# EAGLE schematic node (EAGLE 9.4.2)
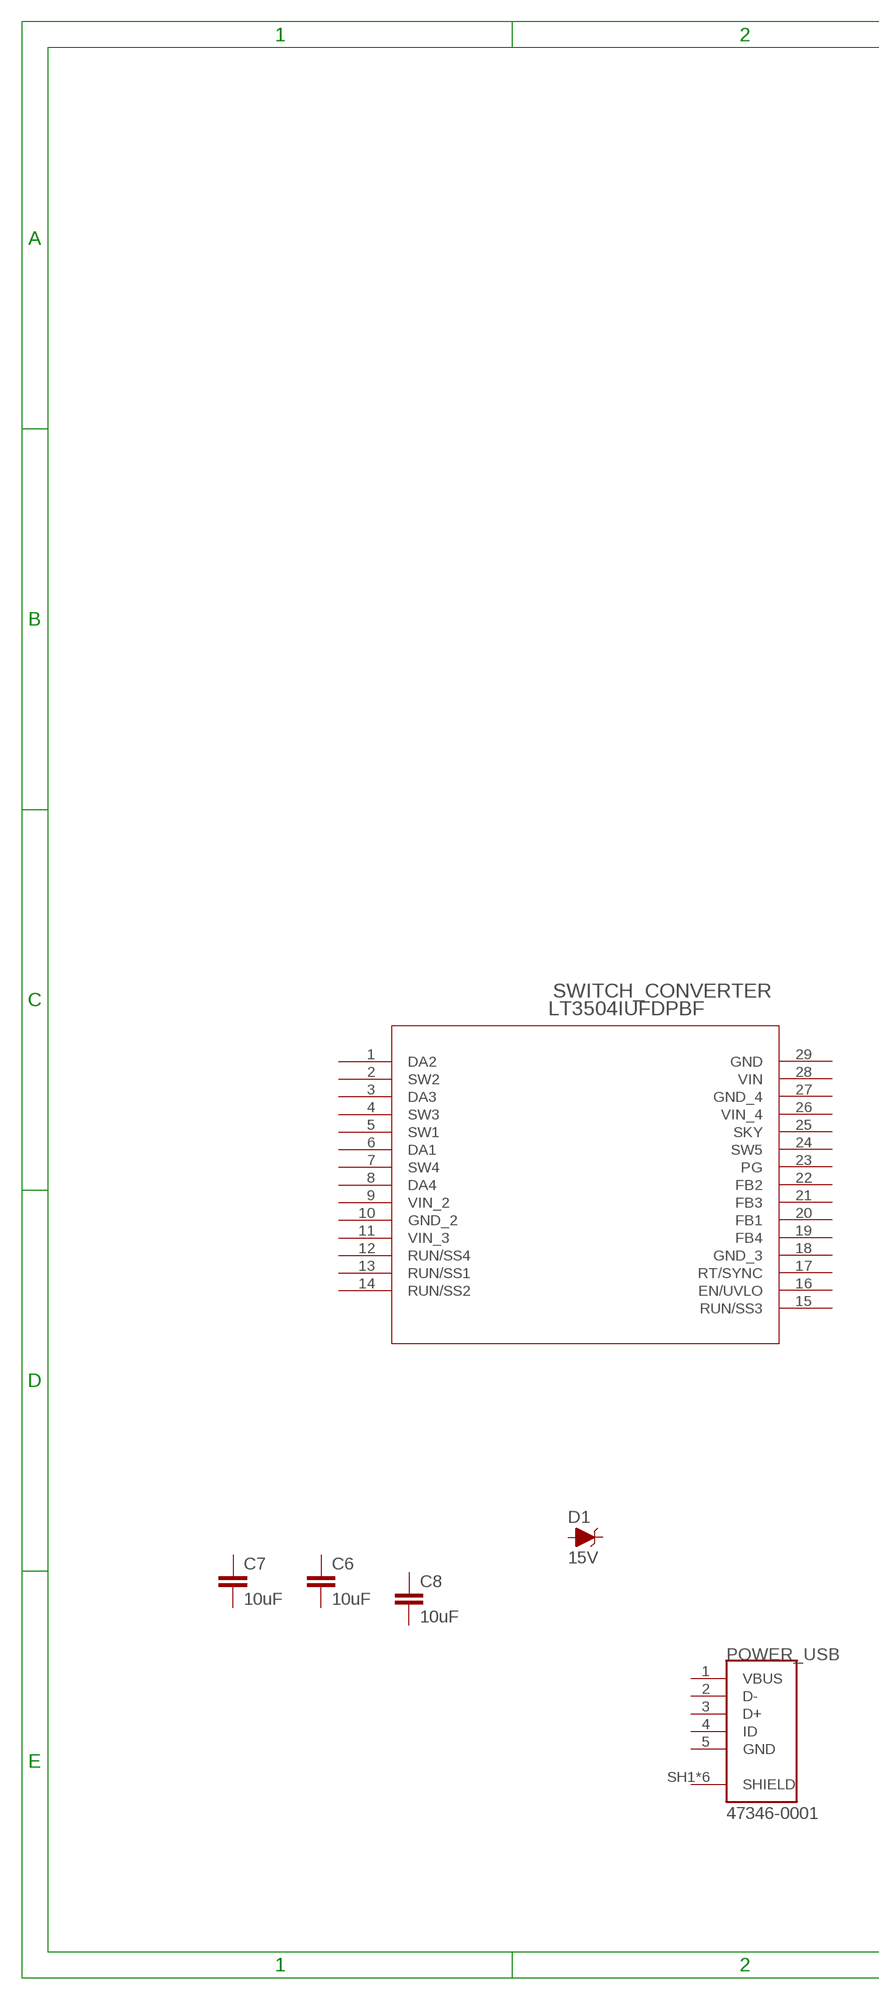
[diagram p0: schematic, sheet 1, part 1 of 2]
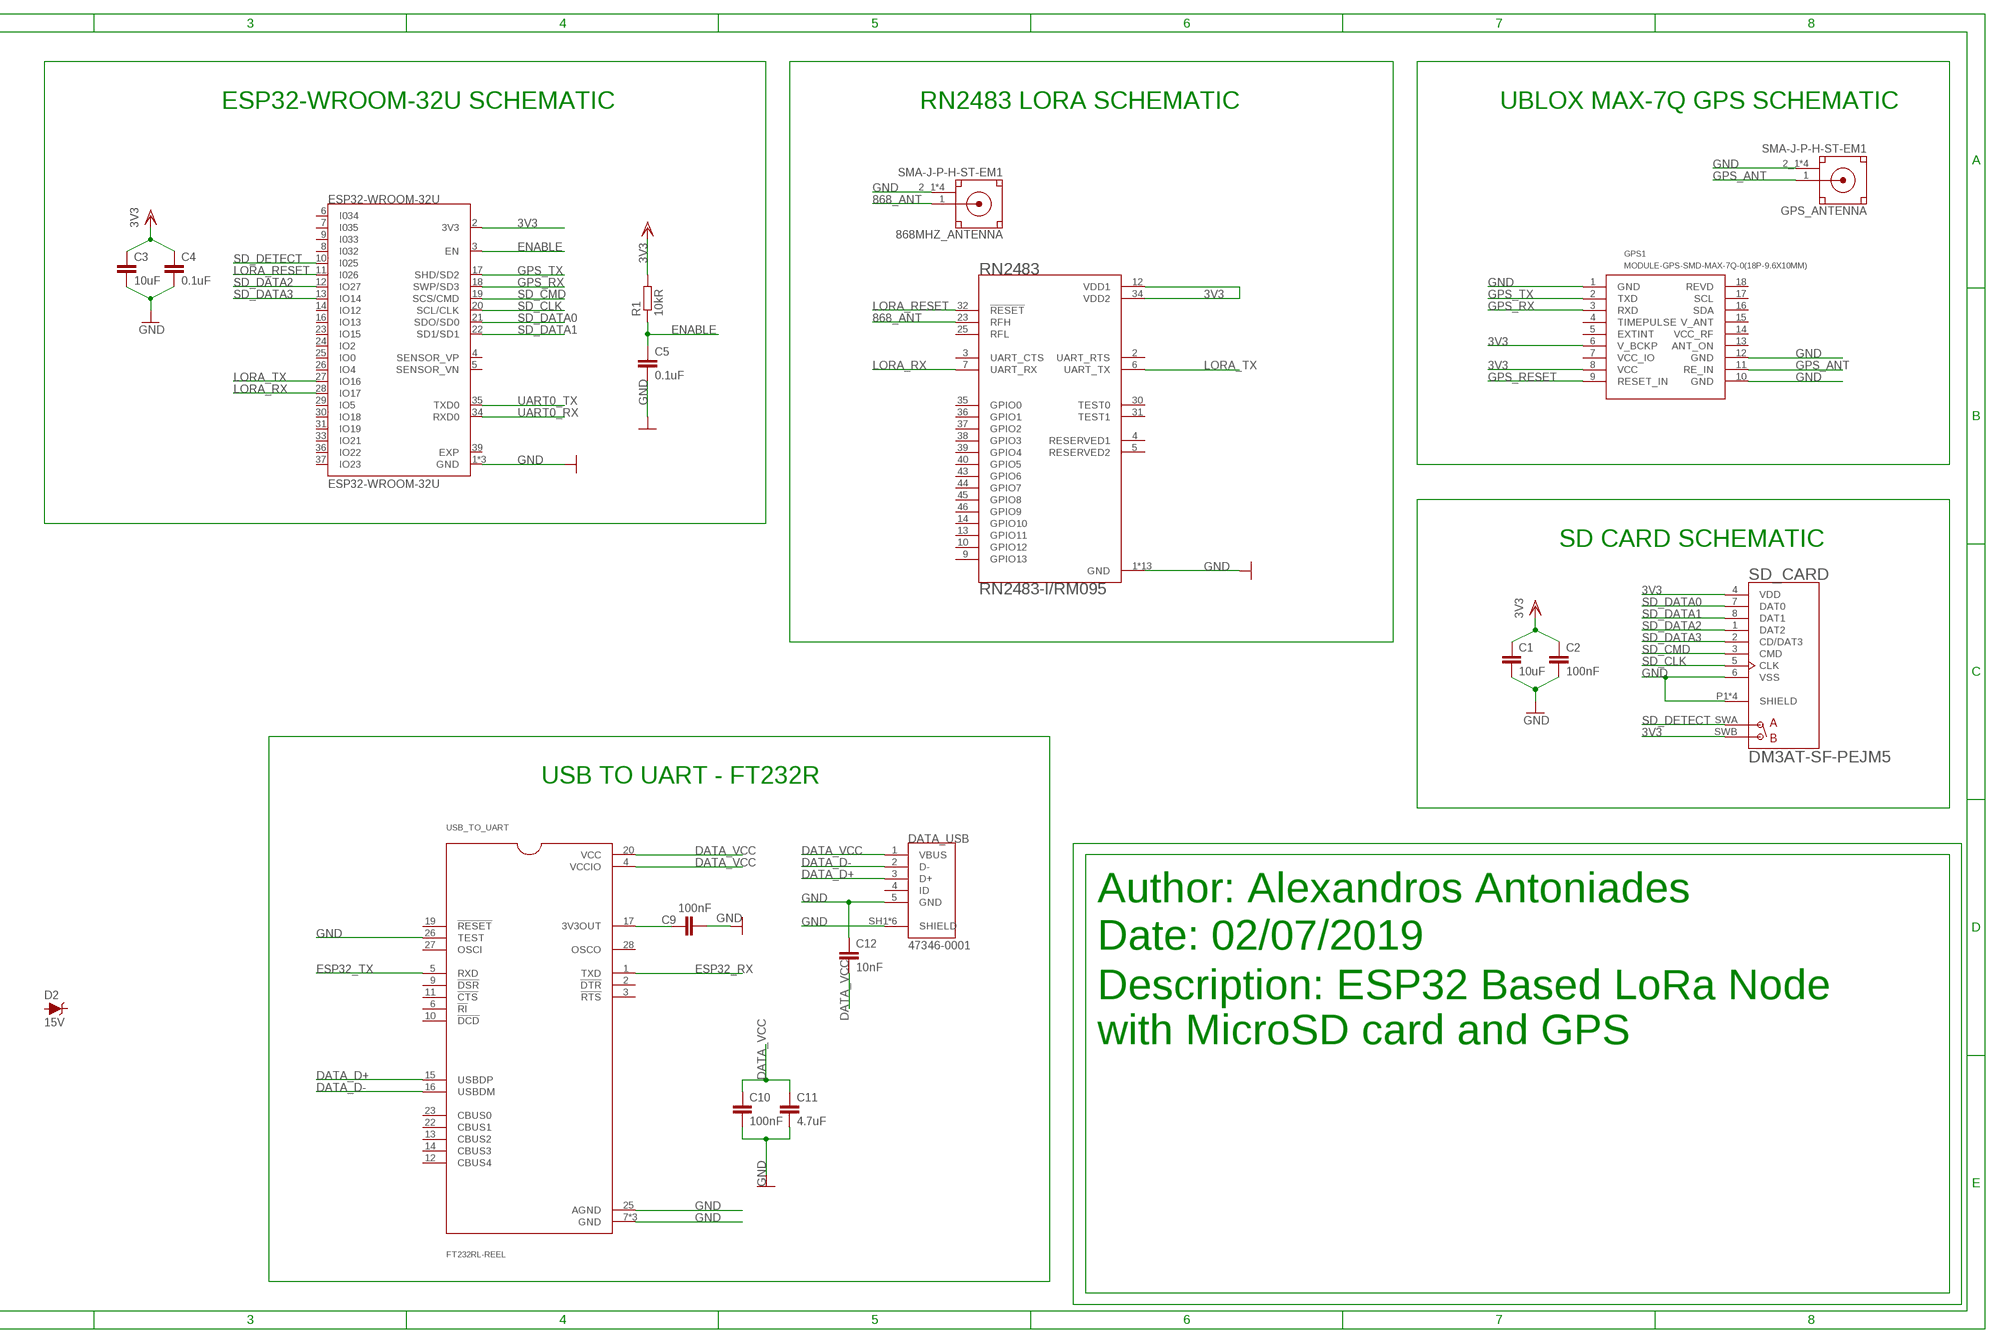
[diagram p1: schematic, sheet 1, part 2 of 2]

## Parts
868MHZ_ANTENNA  SMA-J-P-H-ST-EM1  [SMA-J-P-H-ST-EM1]
C1  10uF  C-EUC0603  [C0603]
C2  100nF  C-EUC0603  [C0603]
C3  10uF  C-EUC0603  [C0603]
C4  0.1uF  C-EUC0603  [C0603]
C5  0.1uF  C-EUC0603  [C0603]
C6  10uF  C-EUC0603  [C0603]
C7  10uF  C-EUC0603  [C0603]
C8  10uF  C-EUC0603  [C0603]
C9  100nF  C-EUC0603  [C0603]
C10  100nF  C-EUC0603  [C0603]
C11  4.7uF  C-EUC0603  [C0603]
C12  10nF  C-EUC0603  [C0603]
D1  15V  DIODE-ZENER-DZ2J150M0L  [PANASONIC_SMINI2-F5-B]
D2  15V  DIODE-ZENER-DZ2J150M0L  [PANASONIC_SMINI2-F5-B]
DATA_USB  47346-0001  [MOLEX_47346-0001]
ESP32-WROOM-32U  ESP32-WROOM-32U  [XCVR_ESP32-WROOM-32U]
GPS1  MODULE-GPS-SMD-MAX-7Q-0(18P-9.6X10MM)  [GPS18P-SMD-1.1-10X9.6MM]
GPS_ANTENNA  SMA-J-P-H-ST-EM1  [SMA-J-P-H-ST-EM1]
POWER_USB  47346-0001  [MOLEX_47346-0001]
R1  10kR  R-EU_R0603  [R0603]
RN2483  RN2483-I/RM095  [MICROCHIP_RN2483-I/RM095]
SD_CARD  DM3AT-SF-PEJM5  [HRS_DM3AT-SF-PEJM5]
SWITCH_CONVERTER  LT3504IUFDPBF  [QFN-28_UFD]
USB_TO_UART  FT232RL-REEL  [SOP65P780X200-28N]

## Nets
3V3: C1.1 C2.1 C3.1 C4.1 ESP32-WROOM-32U.2(3V3) GPS1.6(V_BCKP) GPS1.8(VCC) R1.2 RN2483.12(VDD1) RN2483.34(VDD2) SD_CARD.4(VDD) SD_CARD.SWB(B) ; supply symbol labelled VDD
868_ANT: 868MHZ_ANTENNA.1(SIGNAL) RN2483.23(RFH)
DATA_D+: DATA_USB.3(D+) USB_TO_UART.15(USBDP)
DATA_D-: DATA_USB.2(D-) USB_TO_UART.16(USBDM)
DATA_VCC: C10.1 C11.1 C12.2 DATA_USB.1(VBUS) USB_TO_UART.4(VCCIO) USB_TO_UART.20(VCC)
ENABLE: C5.1 ESP32-WROOM-32U.3(EN) R1.1
ESP32_RX: USB_TO_UART.1(TXD)
ESP32_TX: USB_TO_UART.5(RXD)
GND: 868MHZ_ANTENNA.2_1(GND) 868MHZ_ANTENNA.2_2(GND) 868MHZ_ANTENNA.3_1(GND) 868MHZ_ANTENNA.3_2(GND) C1.2 C2.2 C3.2 C4.2 C5.2 C9.2 C10.2 C11.2 C12.1 DATA_USB.5(GND) DATA_USB.SH1(SHIELD) DATA_USB.SH2(SHIELD) DATA_USB.SH3(SHIELD) DATA_USB.SH4(SHIELD) DATA_USB.SH5(SHIELD) DATA_USB.SH6(SHIELD) ESP32-WROOM-32U.1(GND) ESP32-WROOM-32U.15(GND) ESP32-WROOM-32U.38(GND) GPS1.1(GND) GPS1.10(GND) GPS1.12(GND) GPS_ANTENNA.2_1(GND) GPS_ANTENNA.2_2(GND) GPS_ANTENNA.3_1(GND) GPS_ANTENNA.3_2(GND) RN2483.1(GND) RN2483.8(GND) RN2483.11(GND) RN2483.20(GND) RN2483.21(GND) RN2483.22(GND) RN2483.24(GND) RN2483.26(GND) RN2483.27(GND) RN2483.28(GND) RN2483.33(GND) RN2483.41(GND) RN2483.47(GND) SD_CARD.6(VSS) SD_CARD.P1(SHIELD) SD_CARD.P2(SHIELD) SD_CARD.P3(SHIELD) SD_CARD.P4(SHIELD) USB_TO_UART.7(GND) USB_TO_UART.18(GND) USB_TO_UART.21(GND) USB_TO_UART.25(AGND) USB_TO_UART.26(TEST)
GPS_ANT: GPS1.11(RE_IN) GPS_ANTENNA.1(SIGNAL)
GPS_RESET: GPS1.9(RESET_IN)
GPS_RX: ESP32-WROOM-32U.18(SWP/SD3) GPS1.3(RXD)
GPS_TX: ESP32-WROOM-32U.17(SHD/SD2) GPS1.2(TXD)
LORA_RESET: ESP32-WROOM-32U.11(I026) RN2483.32(!RESET)
LORA_RX: ESP32-WROOM-32U.28(IO17) RN2483.7(UART_RX)
LORA_TX: ESP32-WROOM-32U.27(IO16) RN2483.6(UART_TX)
N$8: C9.1 USB_TO_UART.17(3V3OUT)
SD_CLK: ESP32-WROOM-32U.20(SCL/CLK) SD_CARD.5(CLK)
SD_CMD: ESP32-WROOM-32U.19(SCS/CMD) SD_CARD.3(CMD)
SD_DATA0: ESP32-WROOM-32U.21(SDO/SD0) SD_CARD.7(DAT0)
SD_DATA1: ESP32-WROOM-32U.22(SD1/SD1) SD_CARD.8(DAT1)
SD_DATA2: ESP32-WROOM-32U.12(IO27) SD_CARD.1(DAT2)
SD_DATA3: ESP32-WROOM-32U.13(IO14) SD_CARD.2(CD/DAT3)
SD_DETECT: ESP32-WROOM-32U.10(I025) SD_CARD.SWA(A)
UART0_RX: ESP32-WROOM-32U.34(RXD0)
UART0_TX: ESP32-WROOM-32U.35(TXD0)
Unconnected: C6.1 C6.2 C7.1 C7.2 C8.1 C8.2 D1.A D1.C D2.A D2.C DATA_USB.4(ID) ESP32-WROOM-32U.4(SENSOR_VP) ESP32-WROOM-32U.5(SENSOR_VN) ESP32-WROOM-32U.6(I034) ESP32-WROOM-32U.7(I035) ESP32-WROOM-32U.8(I032) ESP32-WROOM-32U.9(I033) ESP32-WROOM-32U.14(IO12) ESP32-WROOM-32U.16(IO13) ESP32-WROOM-32U.23(IO15) ESP32-WROOM-32U.24(IO2) ESP32-WROOM-32U.25(IO0) ESP32-WROOM-32U.26(IO4) ESP32-WROOM-32U.29(IO5) ESP32-WROOM-32U.30(IO18) ESP32-WROOM-32U.31(IO19) ESP32-WROOM-32U.33(IO21) ESP32-WROOM-32U.36(IO22) ESP32-WROOM-32U.37(IO23) GPS1.4(TIMEPULSE) GPS1.5(EXTINT) GPS1.7(VCC_IO) GPS1.13(ANT_ON) GPS1.14(VCC_RF) GPS1.15(V_ANT) GPS1.16(SDA) GPS1.17(SCL) GPS1.18(REVD) POWER_USB.2(D-) POWER_USB.3(D+) POWER_USB.4(ID) POWER_USB.SH1(SHIELD) POWER_USB.SH2(SHIELD) POWER_USB.SH3(SHIELD) POWER_USB.SH4(SHIELD) POWER_USB.SH5(SHIELD) POWER_USB.SH6(SHIELD) RN2483.2(UART_RTS) RN2483.3(UART_CTS) RN2483.4(RESERVED1) RN2483.5(RESERVED2) RN2483.9(GPIO13) RN2483.10(GPIO12) RN2483.13(GPIO11) RN2483.14(GPIO10) RN2483.25(RFL) RN2483.30(TEST0) RN2483.31(TEST1) RN2483.35(GPIO0) RN2483.36(GPIO1) RN2483.37(GPIO2) RN2483.38(GPIO3) RN2483.39(GPIO4) RN2483.40(GPIO5) RN2483.43(GPIO6) RN2483.44(GPIO7) RN2483.45(GPIO8) RN2483.46(GPIO9) SWITCH_CONVERTER.1(DA2) SWITCH_CONVERTER.2(SW2) SWITCH_CONVERTER.3(DA3) SWITCH_CONVERTER.4(SW3) SWITCH_CONVERTER.5(SW1) SWITCH_CONVERTER.6(DA1) SWITCH_CONVERTER.7(SW4) SWITCH_CONVERTER.8(DA4) SWITCH_CONVERTER.9(VIN_2) SWITCH_CONVERTER.11(VIN_3) SWITCH_CONVERTER.12(RUN/SS4) SWITCH_CONVERTER.13(RUN/SS1) SWITCH_CONVERTER.14(RUN/SS2) SWITCH_CONVERTER.15(RUN/SS3) SWITCH_CONVERTER.16(EN/UVLO) SWITCH_CONVERTER.17(RT/SYNC) SWITCH_CONVERTER.19(FB4) SWITCH_CONVERTER.20(FB1) SWITCH_CONVERTER.21(FB3) SWITCH_CONVERTER.22(FB2) SWITCH_CONVERTER.23(PG) SWITCH_CONVERTER.24(SW5) SWITCH_CONVERTER.25(SKY) SWITCH_CONVERTER.26(VIN_4) SWITCH_CONVERTER.28(VIN) USB_TO_UART.2(!DTR) USB_TO_UART.3(!RTS) USB_TO_UART.6(!RI) USB_TO_UART.9(!DSR) USB_TO_UART.10(!DCD) USB_TO_UART.11(!CTS) USB_TO_UART.12(CBUS4) USB_TO_UART.13(CBUS2) USB_TO_UART.14(CBUS3) USB_TO_UART.19(!RESET) USB_TO_UART.22(CBUS1) USB_TO_UART.23(CBUS0) USB_TO_UART.27(OSCI) USB_TO_UART.28(OSCO)

## Notes on the sheet
- ESP32-WROOM-32U SCHEMATIC | RN2483 LORA SCHEMATIC | UBLOX MAX-7Q GPS SCHEMATIC
- SD CARD SCHEMATIC
- USB TO UART - FT232R
- Author: Alexandros Antoniades
- Date: 02/07/2019
- Description: ESP32 Based LoRa Node 
  with MicroSD card and GPS

## Power pins joined to a net without a drawn wire
EXP: ESP32-WROOM-32U.39(EXP)
GND: POWER_USB.5(GND) SWITCH_CONVERTER.29(GND)
GND_2: SWITCH_CONVERTER.10(GND_2)
GND_3: SWITCH_CONVERTER.18(GND_3)
GND_4: SWITCH_CONVERTER.27(GND_4)
VBUS: POWER_USB.1(VBUS)

## Library data of the parts
868MHZ_ANTENNA GPS_ANTENNA = SMA-J-P-H-ST-EM1:SMA-J-P-H-ST-EM1: Connector SMA F 50Ohm Solder ST Edge Mount Gold Over Nickel Tray; AVAILABILITY: Unavailable; DESCRIPTION: Connector SMA F 50Ohm Solder ST Edge Mount Gold Over Nickel Tray; MF: Samtec; MP: SMA-J-P-H-ST-EM1; PACKAGE: None; PRICE: None
C1-C12 = rcl:C-EU: CAPACITOR, European symbol; SPICEPREFIX: C
D1 D2 = SparkFun-DiscreteSemi:DIODE-ZENER: Zener Diode A Zener diode allows current to flow from its anode to its cathode like a normal semiconductor diode, but it also permits current to flow in the reverse direction when its "Zener voltage" is reached. - WIkipedia; PROD_ID: DIO-12989
DATA_USB POWER_USB = 47346-0001:47346-0001: CONN RCPT 5POS MICRO USB R/A SMD; AVAILABILITY: Unavailable; DESCRIPTION: Micro-USB B Receptacle with Flange, Bottom Mount, SMT, Lead-Free; MF: Molex; MP: 47346-0001; PACKAGE: None; PRICE: None
ESP32-WROOM-32U = ESP32-WROOM-32U:ESP32-WROOM-32U: Wi-Fi/BT BLE Module ESP32-D0WD SPI Flash UART U.FL Conn.; AVAILABILITY: Unavailable; DESCRIPTION: Wi-Fi/BT BLE Module ESP32-D0WD SPI Flash UART U.FL Conn.; MF: Espressif Systems; MP: ESP32-WROOM-32U; PACKAGE: Module Espressif Systems; PRICE: None
GPS1 = MODULE-GPS-SMD-MAX-7Q-0_18P-9.6X10MM_:MODULE-GPS-SMD-MAX-7Q-0(18P-9.6X10MM): 317050009; AVAILABILITY: Unavailable; DESCRIPTION: SMD GPS Module;; MF: u-blox; MP: MAX-7Q-0; PACKAGE: SMD-18 u-blox; PRICE: None
R1 = rcl:R-EU_: RESISTOR, European symbol; SPICEPREFIX: R
RN2483 = RN2483-I_RM095:RN2483-I/RM095: Sub-GHz Dual Band Long Range Transceiver LoRa Module; AVAILABILITY: Unavailable; DESCRIPTION: Sub-GHz Dual Band Long Range Transceiver LoRa Module; MF: Microchip; MP: RN2483-I/RM095; PACKAGE: None; PRICE: None
SD_CARD = DM3AT-SF-PEJM5:DM3AT-SF-PEJM5: DM3 Series 8 Position Right Angle SMT Push Push Ejection MicroSD Card Connector; AVAILABILITY: Unavailable; DESCRIPTION: DM3 RA SMT microSD memory card push/push; MF: Hirose; MP: DM3AT-SF-PEJM5; PACKAGE: None; PRICE: None
SWITCH_CONVERTER = LT3504IUFDPBF:LT3504IUFDPBF; DESCRIPTION: LT3504 - Quad 40V/1A Step-Down Switching Regulator with 100% Duty Cycle Operation; DIGI-KEY_PART_NUMBER: LT3504IUFD#PBF-ND; DIGI-KEY_PURCHASE_URL: https://www.digikey.com/product-detail/en/linear-technology-analog-devices/LT3504IUFD-PBF/LT3504IUFD-PBF-ND/3481904?utm_source=snapeda&utm_medium=aggregator&utm_campaign=symbol; MF: Linear Technology; MP: LT3504IUFD#PBF; PACKAGE: QFN-28 Linear Technology
USB_TO_UART = FT232RL-REEL:FT232RL-REEL: USB to serial UART interface; AVAILABILITY: Unavailable; DESCRIPTION: USB Full Speed to Serial UART IC, Includes Oscillator and EEPROM - SSOP-28; MF: FTDI,; MP: FT232RL-REEL; PACKAGE: SSOP-28 FTDI; PRICE: None